# Altium schematic sheet Comms.SchDoc
size A
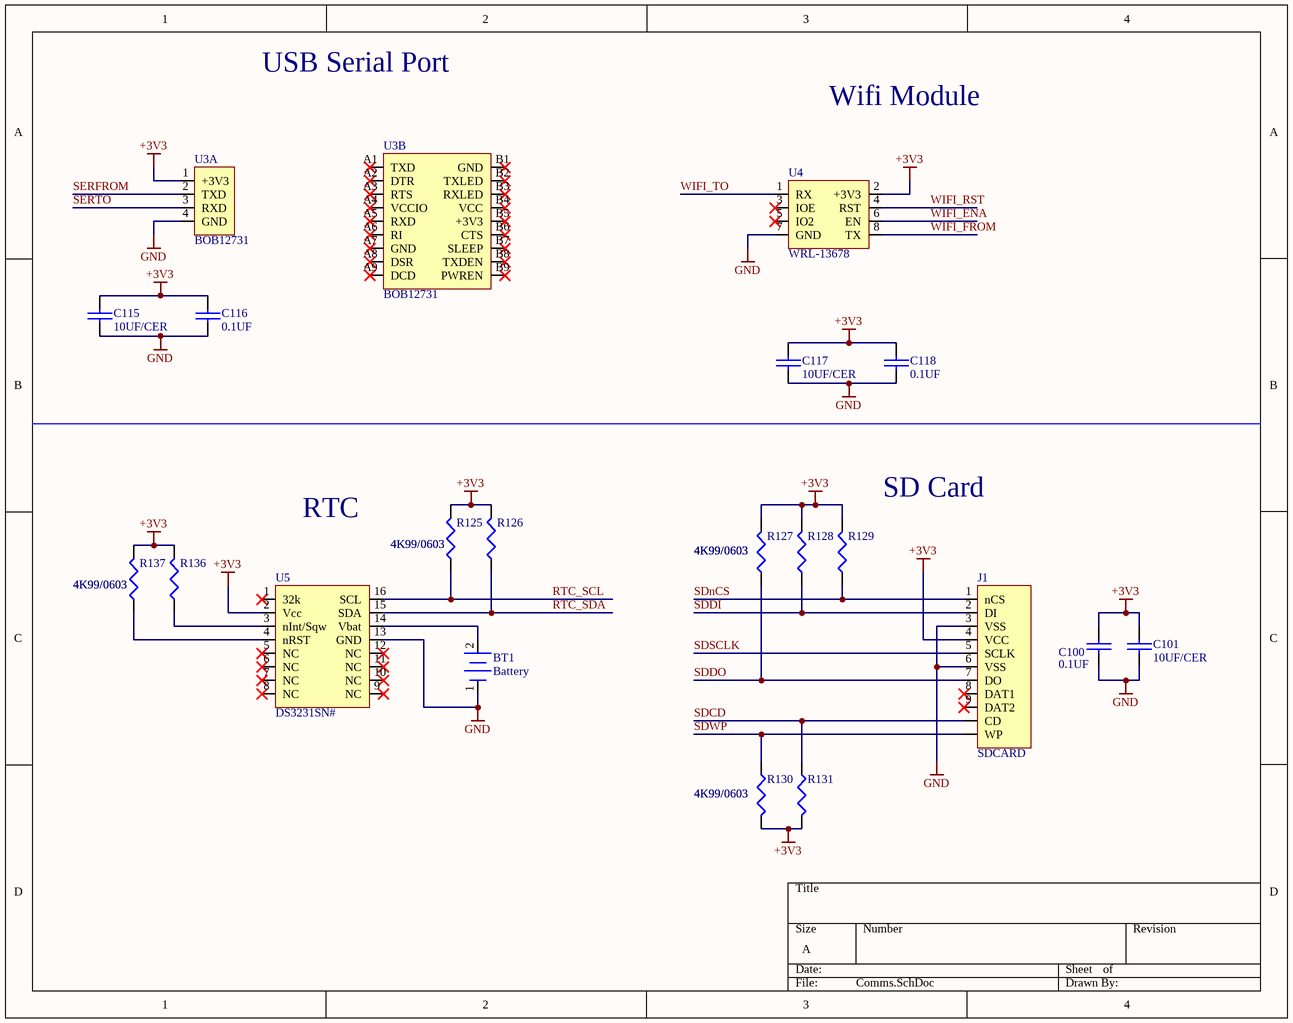
[diagram p0: Comms.SchDoc]

## Parts
BT1  Battery  [BC501SM]
C100  0.1UF  [0603]
C101  10UF/CER  [0805]
C115  10UF/CER  [0805]
C116  0.1UF  [0603]
C117  10UF/CER  [0805]
C118  0.1UF  [0603]
J1  SDCARD  [SDCARD2041021]
R125  4K99/0603  [0603]
R126  4K99/0603  [0603]
R127  4K99/0603  [0603]
R128  4K99/0603  [0603]
R129  4K99/0603  [0603]
R130  4K99/0603  [0603]
R131  4K99/0603  [0603]
R136  4K99/0603  [0603]
R137  4K99/0603  [0603]
U3  BOB12731  [BOB12731]  (parts A,B of 2)
U4  WRL-13678  [WRL13678]
U5  DS3231SN#  [SOL16]

## Nets
+3V3: C100.1 C101.2 C115.2 C116.1 C117.2 C118.1 J1.4(VCC) R125.2 R126.2 R127.2 R128.2 R129.2 R130.2 R131.2 R136.2 R137.2 U3.1(+3V3) U4.2(+3V3) U5.2(Vcc)
GND: BT1.1 C100.2 C101.1 C115.1 C116.2 C117.1 C118.2 J1.3(VSS) J1.6(VSS) U3.4(GND) U4.7(GND) U5.13(GND)
RTC_SCL: R125.1 U5.16(SCL)
RTC_SDA: R126.1 U5.15(SDA)
SDCD: J1.CD R131.1
SDDI: J1.2(DI) R128.1
SDDO: J1.7(DO) R127.1
SDnCS: J1.1(nCS) R129.1
SDSCLK: J1.5(SCLK)
SDWP: J1.WP R130.1
SERFROM: U3.2(TXD)
SERTO: U3.3(RXD)
WIFI_ENA: U4.6(EN)
WIFI_FROM: U4.8(TX)
WIFI_RST: U4.4(RST)
WIFI_TO: U4.1(RX)
NetBT1_2: BT1.2 U5.14(Vbat)
NetR136_1: R136.1 U5.3(nInt/Sqw)
NetR137_1: R137.1 U5.4(nRST)

Not connected (* = marked no-connect by the designer): J1 8(DAT1)* 9(DAT2)*; U3 A1(TXD)* A2(DTR)* A3(RTS)* A4(VCCIO)* A5(RXD)* A6(RI)* A7(GND)* A8(DSR)* A9(DCD)* B1(GND)* B2(TXLED)* B3(RXLED)* B4(VCC)* B5(+3V3)* B6(CTS)* B7(SLEEP)* B8(TXDEN)* B9(PWREN)*; U4 3(IOE)* 5(IO2)*; U5 1(32k)* 5(NC)* 6(NC)* 7(NC)* 8(NC)* 9(NC)* 10(NC)* 11(NC)* 12(NC)*

## Notes on the sheet
- USB Serial Port
- Wifi Module
- (near R129) SD Card
- RTC

## Library data of the parts
BT1 = BC501SM-TR: Battery Holder (Open) Coin, 12.0mm 1 Cell SMD (SMT) Tab; MFG: MPD; DK PN: BC501SM-TR-ND; MFG PN: BC501SM-TR; Price: 1.17
C100 = 0.1UF: CAP .10UF 16V CERAMIC X7R 0603; Text Field1: Kemet; Text Field2: C0603C104K4RACTU; Text Field3: 399-1096-1-ND; Text Field4: 1.17
C101 C115 C117 = 10UF/CER: 10µF ±10% 25V Ceramic Capacitor X7S 0805; Text Field1: Murata; Text Field2: GRM21BC71E106KE11L; Text Field3: 490-10496-1-ND
C116 C118 = 0.1UF: CAP .10UF 16V CERAMIC X7R 0603; MFG: Kemet; MFG PN: C0603C104K4RACTU; DK PN: 399-1096-1-ND; Price: 1.17
J1 = SDCARD: 11 (9 + 2) Position Card Connector Secure Digital - SD Surface Mount, Right Angle Gold; MFG: TE; MFG PN: 2041021-4; DK PN: A101492CT-ND; Price: 3.69
R125-R131 R136 R137 = 4K99/0603: RES 4.99K OHM 1/10W 1% 0603 SMD; MFG: Dale/Vishay; MFG PN: CRCW06034K99FKEAC; DK PN: 541-3985-1-ND; Price: 5.02
U3 = BOB12731: FT232R USB 2.0 to UART Interface Evaluation Board; MFG: SparkFun; MFG PN: BOB-12731; DK PN: 1568-1195-ND; Price: 1.17
U4 = WRL-13678: WiFi 802.11b/g/n Transceiver Module 2.4GHz ~ 2.48GHz Integrated, Trace Through Hole; MFG: SparkFun; DK PN: 1568-1235-ND; MFG PN: WRL-13678; Price: 1.17
U5 = DS3231SN#: Real Time Clock (RTC) IC Clock/Calendar I²C, 2-Wire Serial 16-SOIC (0.295", 7.50mm Width); MFG: Maxim; DK PN: DS3231SN#-ND; MFG PN: DS3231SN#; Price: 9.79